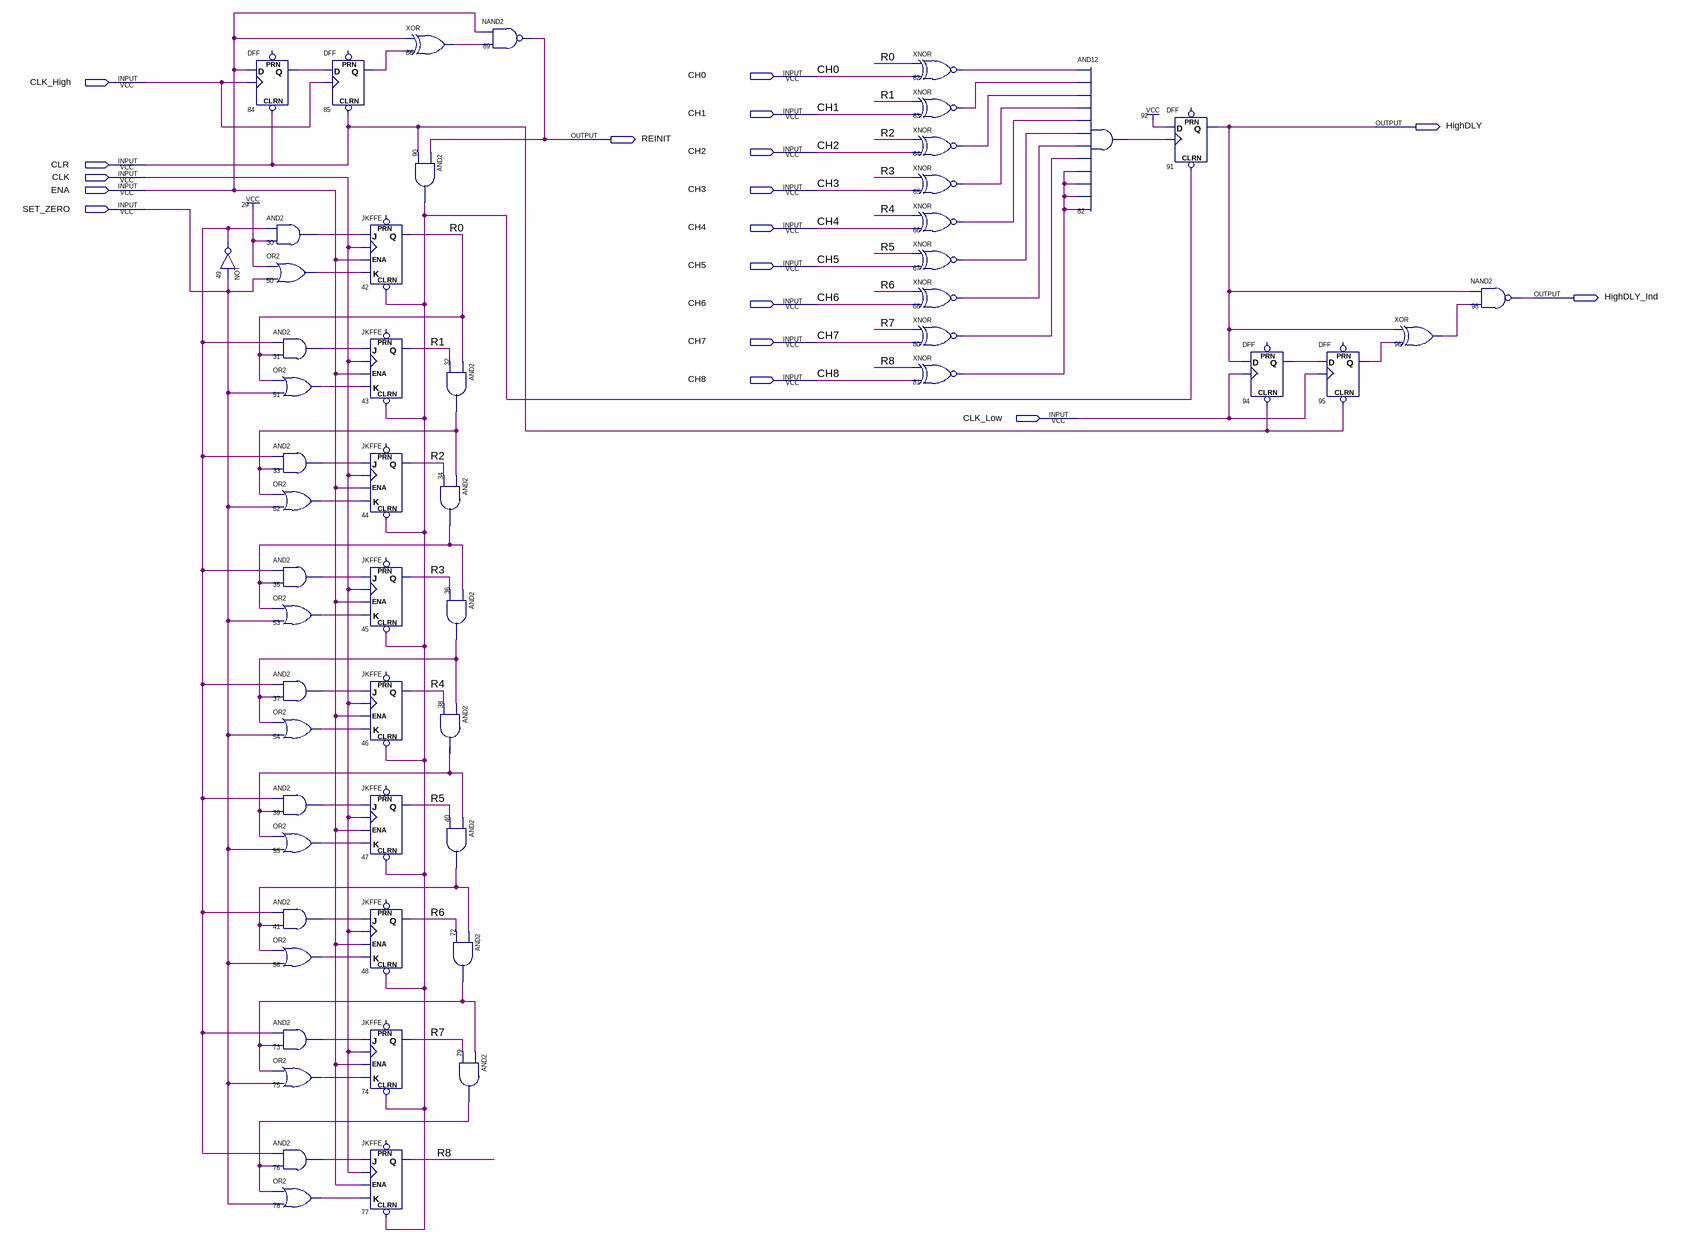
[diagram p0: schematic sheet]
// Quartus schematic net_ctrl.bdf as structural Verilog: 55 symbols, 18 pins
module net_ctrl (
  input  CH0,
  input  CLK_High,
  input  CH1,
  input  CH2,
  input  CLR,
  input  CLK,
  input  ENA,
  input  CH3,
  input  SET_ZERO,
  input  CH4,
  input  CH5,
  input  CH6,
  input  CH7,
  input  CH8,
  input  CLK_Low,
  output HighDLY,
  output REINIT,
  output HighDLY_Ind
);

  wire n30_out, n31_out, n32_out, n33_out, n34_out, n35_out, n36_out, n37_out, n38_out, n39_out, n40_out,
       n41_out, n49_out, n50_out, n51_out, n52_out, n53_out, n54_out, n55_out, n56_out, n62_out, n63_out,
       n64_out, n65_out, n66_out, n67_out, n68_out, n72_out, n73_out, n75_out, n76_out, n78_out, n79_out,
       n80_out, n81_out, n82_out, n84_q, n85_q, n86_out, n90_out, n94_q, n95_q, n96_out, R0, R1, R2, R3, R4,
       R5, R6, R7, R8;

  not u_49 (n49_out, SET_ZERO);
  DFF u_84 (.CLRN(CLR), .CLK(CLK_High), .D(ENA), .Q(n84_q));  // open: PRN
  and u_30 (n30_out, n49_out, 1'b1);
  or u_50 (n50_out, 1'b1, SET_ZERO);
  and u_31 (n31_out, n49_out, R0);
  or u_51 (n51_out, R0, SET_ZERO);
  and u_33 (n33_out, n49_out, n32_out);
  or u_52 (n52_out, n32_out, SET_ZERO);
  and u_35 (n35_out, n49_out, n34_out);
  or u_53 (n53_out, n34_out, SET_ZERO);
  and u_37 (n37_out, n49_out, n36_out);
  or u_54 (n54_out, n36_out, SET_ZERO);
  and u_39 (n39_out, n49_out, n38_out);
  or u_55 (n55_out, n38_out, SET_ZERO);
  and u_41 (n41_out, n49_out, n40_out);
  or u_56 (n56_out, n40_out, SET_ZERO);
  and u_73 (n73_out, n49_out, n72_out);
  or u_75 (n75_out, n72_out, SET_ZERO);
  and u_76 (n76_out, n49_out, n79_out);
  or u_78 (n78_out, n79_out, SET_ZERO);
  DFF u_85 (.CLRN(CLR), .CLK(CLK_High), .D(n84_q), .Q(n85_q));  // open: PRN
  JKFFE u_42 (.J(n30_out), .CLK(CLK), .CLRN(n90_out), .K(n50_out), .ENA(ENA), .Q(R0));  // open: PRN
  JKFFE u_43 (.J(n31_out), .CLK(CLK), .CLRN(n90_out), .K(n51_out), .ENA(ENA), .Q(R1));  // open: PRN
  JKFFE u_44 (.J(n33_out), .CLK(CLK), .CLRN(n90_out), .K(n52_out), .ENA(ENA), .Q(R2));  // open: PRN
  JKFFE u_45 (.J(n35_out), .CLK(CLK), .CLRN(n90_out), .K(n53_out), .ENA(ENA), .Q(R3));  // open: PRN
  JKFFE u_46 (.J(n37_out), .CLK(CLK), .CLRN(n90_out), .K(n54_out), .ENA(ENA), .Q(R4));  // open: PRN
  JKFFE u_47 (.J(n39_out), .CLK(CLK), .CLRN(n90_out), .K(n55_out), .ENA(ENA), .Q(R5));  // open: PRN
  JKFFE u_48 (.J(n41_out), .CLK(CLK), .CLRN(n90_out), .K(n56_out), .ENA(ENA), .Q(R6));  // open: PRN
  JKFFE u_74 (.J(n73_out), .CLK(CLK), .CLRN(n90_out), .K(n75_out), .ENA(ENA), .Q(R7));  // open: PRN
  JKFFE u_77 (.J(n76_out), .CLK(CLK), .CLRN(n90_out), .K(n78_out), .ENA(ENA), .Q(R8));  // open: PRN
  xor u_86 (n86_out, ENA, n85_q);
  and u_90 (n90_out, REINIT, CLR);
  and u_34 (n34_out, n32_out, R2);
  and u_38 (n38_out, n36_out, R4);
  nand u_89 (REINIT, ENA, n86_out);
  and u_32 (n32_out, R0, R1);
  and u_36 (n36_out, n34_out, R3);
  and u_40 (n40_out, n38_out, R5);
  and u_72 (n72_out, n40_out, R6);
  and u_79 (n79_out, n72_out, R7);
  xnor u_62 (n62_out, R0, CH0);
  xnor u_63 (n63_out, R1, CH1);
  xnor u_64 (n64_out, R2, CH2);
  xnor u_65 (n65_out, R3, CH3);
  xnor u_66 (n66_out, R4, CH4);
  xnor u_67 (n67_out, R5, CH5);
  xnor u_68 (n68_out, R6, CH6);
  xnor u_80 (n80_out, R7, CH7);
  xnor u_81 (n81_out, R8, CH8);
  and u_82 (n82_out, n62_out, n63_out, n64_out, n65_out, n66_out, n67_out, n68_out, n80_out, n81_out, n81_out, n81_out, n81_out);
  DFF u_91 (.CLRN(n90_out), .CLK(n82_out), .D(1'b1), .Q(HighDLY));  // open: PRN
  DFF u_94 (.CLRN(CLR), .CLK(CLK_Low), .D(HighDLY), .Q(n94_q));  // open: PRN
  DFF u_95 (.CLRN(CLR), .CLK(CLK_Low), .D(n94_q), .Q(n95_q));  // open: PRN
  xor u_96 (n96_out, HighDLY, n95_q);
  nand u_98 (HighDLY_Ind, HighDLY, n96_out);
endmodule
